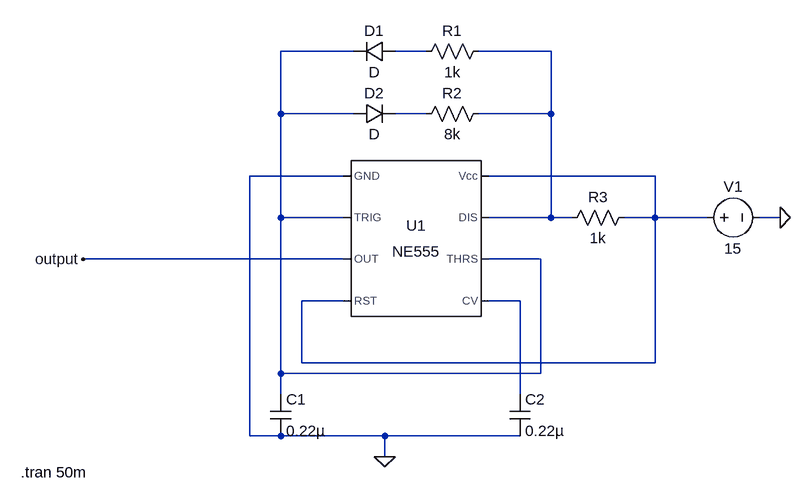
[diagram p0: schematic 555timer.asc]
555timer.asc, the LTspice schematic file:
Version 4
SHEET 1 880 680
WIRE 192 -112 80 -112
WIRE 304 -112 256 -112
WIRE 496 -112 384 -112
WIRE 80 -16 80 -112
WIRE 192 -16 80 -16
WIRE 304 -16 256 -16
WIRE 496 -16 496 -112
WIRE 496 -16 384 -16
WIRE 176 80 32 80
WIRE 656 80 400 80
WIRE 80 144 80 -16
WIRE 176 144 80 144
WIRE 496 144 496 -16
WIRE 496 144 400 144
WIRE 528 144 496 144
WIRE 656 144 656 80
WIRE 656 144 608 144
WIRE 736 144 656 144
WIRE 848 144 816 144
WIRE 176 208 -224 208
WIRE 480 208 400 208
WIRE 176 272 112 272
WIRE 448 272 400 272
WIRE 112 368 112 272
WIRE 656 368 656 144
WIRE 656 368 112 368
WIRE 80 384 80 144
WIRE 480 384 480 208
WIRE 480 384 80 384
WIRE 80 416 80 384
WIRE 448 416 448 272
WIRE 32 480 32 80
WIRE 80 480 32 480
WIRE 240 480 80 480
WIRE 448 480 240 480
WIRE 240 512 240 480
FLAG 848 144 0
FLAG 240 512 0
FLAG -224 208 output
SYMBOL Misc\\NE555 288 176 R0
SYMATTR InstName U1
SYMBOL voltage 720 144 R270
WINDOW 0 32 56 VTop 2
WINDOW 3 -32 56 VBottom 2
WINDOW 123 0 0 Left 0
WINDOW 39 0 0 Left 0
SYMATTR InstName V1
SYMATTR Value 15
SYMBOL diode 256 -128 R90
WINDOW 0 0 32 VBottom 2
WINDOW 3 32 32 VTop 2
SYMATTR InstName D1
SYMBOL diode 192 0 R270
WINDOW 0 32 32 VTop 2
WINDOW 3 0 32 VBottom 2
SYMATTR InstName D2
SYMBOL res 400 -128 R90
WINDOW 0 0 56 VBottom 2
WINDOW 3 32 56 VTop 2
SYMATTR InstName R1
SYMATTR Value 1k
SYMBOL res 400 -32 R90
WINDOW 0 0 56 VBottom 2
WINDOW 3 32 56 VTop 2
SYMATTR InstName R2
SYMATTR Value 8k
SYMBOL res 512 160 R270
WINDOW 0 32 56 VTop 2
WINDOW 3 0 56 VBottom 2
SYMATTR InstName R3
SYMATTR Value 1k
SYMBOL cap 64 416 R0
SYMATTR InstName C1
SYMATTR Value 0.22µ
SYMBOL cap 432 416 R0
SYMATTR InstName C2
SYMATTR Value 0.22µ
TEXT -320 536 Left 2 !.tran 50m

The netlist it stands for:
* 555timer.asc
XU1 0 N001 output N005 N006 N001 N003 N005 NE555  ; pins GND TRIG OUT RST CV THRS DIS Vcc
V1 N005 0 15
D1 N002 N001 D
D2 N001 N004 D
R1 N003 N002 1k
R2 N003 N004 8k
R3 N003 N005 1k
C1 N001 0 0.22µ
C2 N006 0 0.22µ
.model D D
.lib standard.dio
.tran 50m
.lib NE555.sub
.backanno
.end